# EAGLE design BreakBeamReceiver (EAGLE 6.5.0)
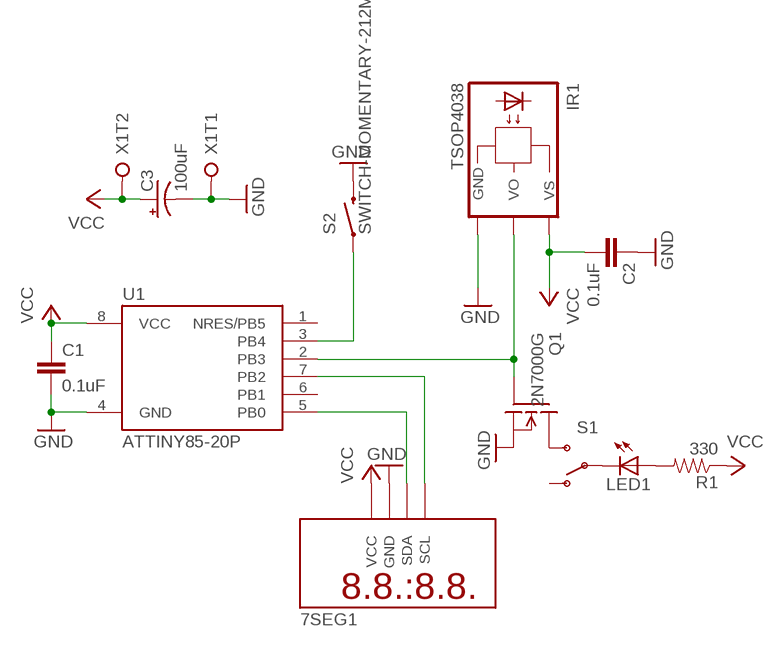
[diagram p0: schematic, sheet 1]

## Parts
7SEG1  7-SEGMENT-BACKPACK  [7-SEGMENT-BACKPACK]
C1  0.1uF  CAPACITOR-5MM  [CAPACITOR-5MM]
C2  0.1uF  CAPACITOR-5MM  [CAPACITOR-5MM]
C3  100uF  CAP_POLPTH1  [CPOL-RADIAL-100UF-25V]
IR1  TSOP4038  [TSOP]
LED1  LED5MM  [LED5MM]
Q1  2N7000G  [TO92-INLINE]
R1  330  RESISTOR-5MM  [AXIAL-5MM]
S1  SWITCH-SPDTPTH  [SWITCH-SPDT]
S2  SWITCH-MOMENTARY-212MM  [TACTILE-PTH-12MM]
U1  ATTINY85-20P  [PDIP08_300MIL]
X1  SCREW-TERM-2  [SCREW-TERM-2]

## Nets
GND: 7SEG1.GND C1.2 C2.1 C3.2(-) IR1.GND Q1.1(SRC) S2.3 U1.4(GND) X1.1
N$1: LED1.K(C) S1.2(P)
N$2: LED1.A R1.P$2
N$3: Q1.3(DRN) S1.3(S)
N$4: IR1.VO Q1.2(GATE) U1.2(PB3)
N$5: S2.1 U1.3(PB4)
N$6: 7SEG1.SDA U1.5(PB0)
N$7: 7SEG1.SCL U1.7(PB2)
VCC: 7SEG1.VCC C1.1 C2.2 C3.1(+) IR1.VS R1.P$1 U1.8(VCC) X1.2
Unconnected: S1.1(O) U1.1(NRES/PB5) U1.6(PB1)

## Library data of the parts
7SEG1 = SaintGimp:7-SEGMENT-BACKPACK: Adafruit 4-digit 7-segment I2C backpack
C1 C2 = SaintGimp:CAPACITOR-*: Ceramic Capacitor
C3 = SparkFun-Capacitors:CAP_POL: Capacitor Polarized These are standard SMD and PTH capacitors. Normally 10uF, 47uF, and 100uF in electrolytic and tantalum varieties. Always verify the external diameter of the through hole cap, it varies with capacity, voltage, and manufacturer. The EIA devices should be standard.
IR1 = SaintGimp:TSOP4038: TSOP4038 IR Receiver Module Source: http://www.vishay.com/docs/81926/tsop4038.pdf
LED1 = adafruit:LED: LED OSRAM: - CHIPLED LG R971, LG N971, LY N971, LG Q971, LY Q971, LO R971, LY R971 LH N974, LH R974 LS Q976, LO Q976, LY Q976 LO Q996 - Hyper CHIPLED LW Q18S LB Q993, LB Q99A, LB R99A - SideLED LS A670, LO A670, LY A670, LG A670, LP A670 LB A673, LV A673, LT A673, LW A673 LH A674 LY A675 LS A676, LA A676, LO A676, LY A676, LW A676 LS A679, LY A679, LG A679 - Hyper Micro SIDELED® LS Y876, LA Y876, LO Y876, LY Y876 LT Y87S - SmartLED LW L88C, LW L88S LB L89C, LB L89S, LG L890 LS L89K, LO L89K, LY L89K LS L896, LA L896, LO L896, LY L896 - TOPLED LS T670, LO T670, LY T670, LG T670, LP T670 LSG T670, LSP T670, LSY T670, LOP T670, LYG T670 LG T671, LOG T671, LSG T671 LB T673, LV T673, LT T673, LW T673 LH T674 LS T676, LA T676, LO T676, LY T676, LB T676, LH T676, LSB T676, LW T676 LB T67C, LV T67C, LT T67C, LS T67K, LO T67K, LY T67K, LW E67C LS E67B, LA E67B, LO E67B, LY E67B, LB E67C, LV E67C, LT E67C LW T67C LS T679, LY T679, LG T679 LS T770, LO T770, LY T770, LG T770, LP T770 LB T773, LV T773, LT T773, LW T773 LH T774 LS E675, LA E675, LY E675, LS T675 LS T776, LA T776, LO T776, LY T776, LB T776 LHGB T686 LT T68C, LB T68C - Hyper Mini TOPLED® LB M676 - Mini TOPLED Santana® LG M470 LS M47K, LO M47K, LY M47K Source: http://www.osram.convergy.de/
Q1 = SaintGimp:2N7000G: N-Channel Enhancement MOSFET 60V; 200mA; 5 ohm
R1 = SaintGimp:RESISTOR-*
S1 = SparkFun-Electromechanical:SWITCH-SPDT: SPDT Switch Simple slide switch, Spark Fun Electronics SKU : COM-00102 DPDT SMT slide switch, AYZ0202, SWCH-08179
S2 = SparkFun-Electromechanical:SWITCH-MOMENTARY-2: Various NO switches- pushbuttons, reed, etc; PROD_ID: SWCH-09185
U1 = _hhn_attiny25_45_85:ATTINY85*: ATMEL ATtiny 85 Packages: P = PDIP 08 30mil S = SOIC 08 EIAJ 208mil Technologies Note: for complete ordering code (temp. range, finish, tape&reel etc.) see www.atmel.com • Supply Voltage: V = (1.8…5.5)V | [blank] = (2.7…5.5)V • Speed: 10 = 10 MHz | 20 = 20 MHz Author: Dipl.-Ing. FH Rainer Bayer HHN Hochschule Heilbronn (Heilbronn University), rainer.bayer@hs-heilbronn.de Ingenieurbüro ing-rb, mail@ing-rb.de
X1 = SaintGimp:SCREW-TERM-2: 2-Pin Screw Terminal

## Board
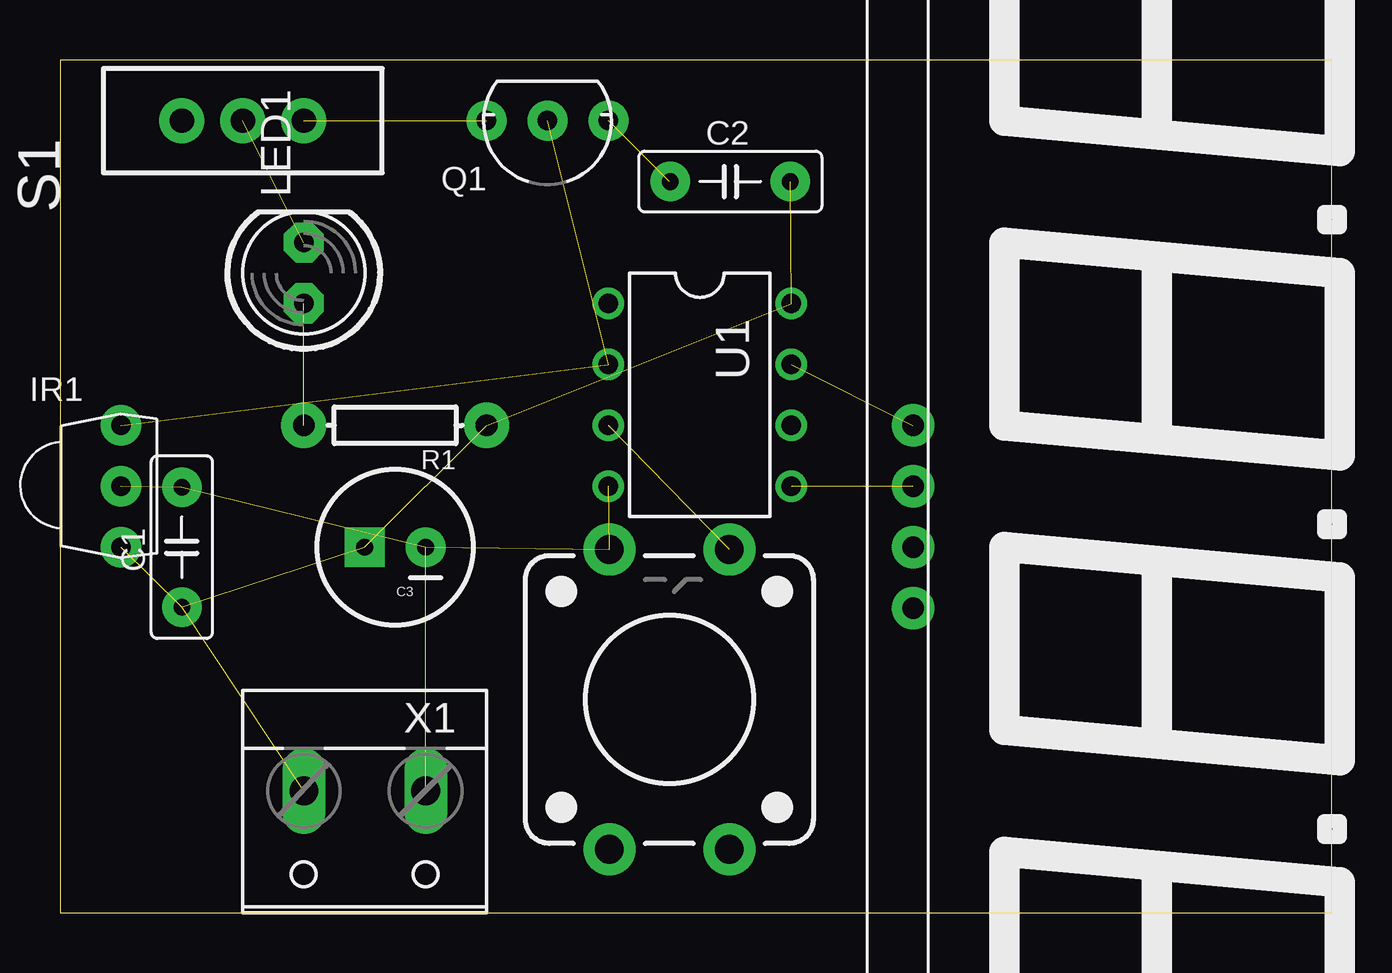
[diagram p1: board, top side]
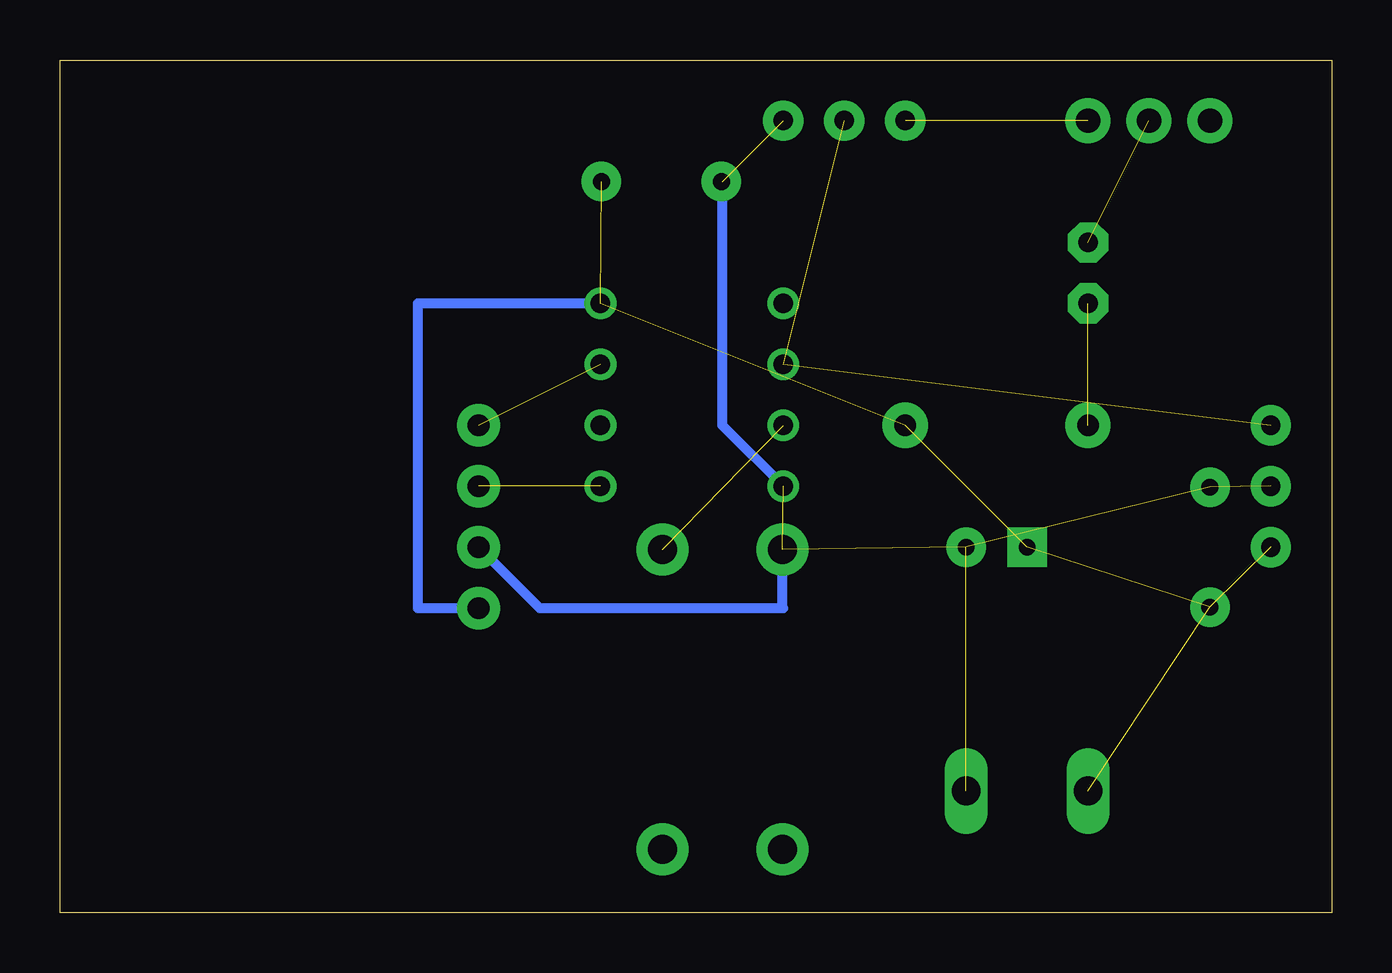
[diagram p2: board, bottom side, seen from below]

Size 53.01 x 35.55 mm. Coordinates in mm from the lower left corner, seen from the top.
Outline: 0,0 53.01,0 53.01,35.55 0,35.55 0,0
Copper layers (1*16): Top 0.035mm / dielectric 1.5mm / Bottom 0.035mm
Design rules "default": minimum track width 10mil, minimum drill 24mil, track to track 8mil, track to pad 8mil, pad to pad 8mil, via to via 8mil, smd to smd 8mil, copper to edge 40mil, drill to drill 8mil, minimum pad ring 10mil, minimum via ring 8mil, stop-mask expansion 4mil, vias tented up to drill 0mil, thermal gap 10mil

### Footprints (pad centres in the part's own frame; a part is rotated, then mirrored left to right if it is on the bottom)
7-SEGMENT-BACKPACK = drill 0.9 pad 1.778: GND -2.54,10.16; SCL 2.54,10.16; SDA 0,10.16; VCC -5.08,10.16
CAPACITOR-5MM = drill 0.7 pad 1.651: 1 -2.5,0; 2 2.5,0
CPOL-RADIAL-100UF-25V = drill 0.7 pad 1.651 square: 1 1.27,0 | drill 0.7 pad 1.651: 2 -1.27,0
TSOP = drill 0.8 pad 1.676: GND 0,0; VO 0,2.54; VS 0,-2.54
LED5MM = drill 0.813 pad 1.676 octagon: A -1.27,0; K 1.27,0
TO92-INLINE = drill 0.813 pad 1.676: 1 -2.54,0; 2 0,0; 3 2.54,0
AXIAL-5MM = drill 0.9 pad 1.88: P$1 -3.81,0; P$2 3.81,0
SWITCH-SPDT = drill 1.016 pad 1.88: 1 0,2.54; 2 0,0; 3 0,-2.54
TACTILE-PTH-12MM = drill 1.2 pad 2.159: 1 6.25,-2.5; 2 -6.25,-2.5; 3 6.25,2.5; 4 -6.25,2.5
PDIP08_300MIL = drill 0.813: 1 -3.81,-3.81; 2 -1.27,-3.81; 3 1.27,-3.81; 4 3.81,-3.81; 5 3.81,3.81; 6 1.27,3.81; 7 -1.27,3.81; 8 -3.81,3.81
SCREW-TERM-2 = drill 1.194 long: 1 -2.54,0; 2 2.54,0

### Placement (x,y rotation side)
7SEG1  45.72,17.78 90 top
C1  5.08,15.24 90 top
C2  27.94,30.48 0 top
C3  13.97,15.24 180 top
IR1  2.54,17.78 0 top
LED1  10.16,26.67 90 top
Q1  20.32,33.02 180 top
R1  13.97,20.32 180 top
S1  7.62,33.02 90 top
S2  25.4,8.89 90 top
U1  26.67,21.59 270 top
X1  12.7,5.08 180 top

### Tracks (layer width: path | path; a pad name or v marks a point on that pad's centre or on a via)
GND  (6 unrouted)
  Bottom 0.406: U1.4 25.4,20.32 25.4,30.48 C2.1 | 7SEG1.GND 33.02,12.7 22.86,12.7 22.9,12.74 S2.3
N$1  (1 unrouted)
N$2  (1 unrouted)
N$3  (1 unrouted)
N$4  (2 unrouted)
N$5  (1 unrouted)
N$6  (1 unrouted)
N$7  (1 unrouted)
VCC  (6 unrouted)
  Bottom 0.406: U1.8 38.1,25.4 38.1,12.7 7SEG1.VCC